# Altium schematic sheet POWR001_BCR_ LT3652.SchDoc: BLUEsat Peak Power Tracker
size A3; Author: William Du; Engineer: William Du; Organization: BLUEsat Project; Address1: Room 419; Address2: School of EE&T; Address3: UNSW, NSW 2052; Address4: Australia; DocumentNumber: POWR0001; SheetNumber: 1; SheetTotal: 1; PageSetup: Record=PageOptions?CenterHorizontal=True?CenterVertical=True?PrintScale=1.00?XCorrection=1.00?YCorrection=1.00?PrintKind=1?BorderSize=5000000?LeftOffset=0?BottomOffset=0?Orientation=2?PaperLength=1000?PaperWidth=1000?Scale=100?PaperSource=7?PrintQuality=-4?MediaType=1?DitherType=10?PaperKind=A4?PrintScaleMode=0; Description: Battery Charge Regulator; Version: 1.0
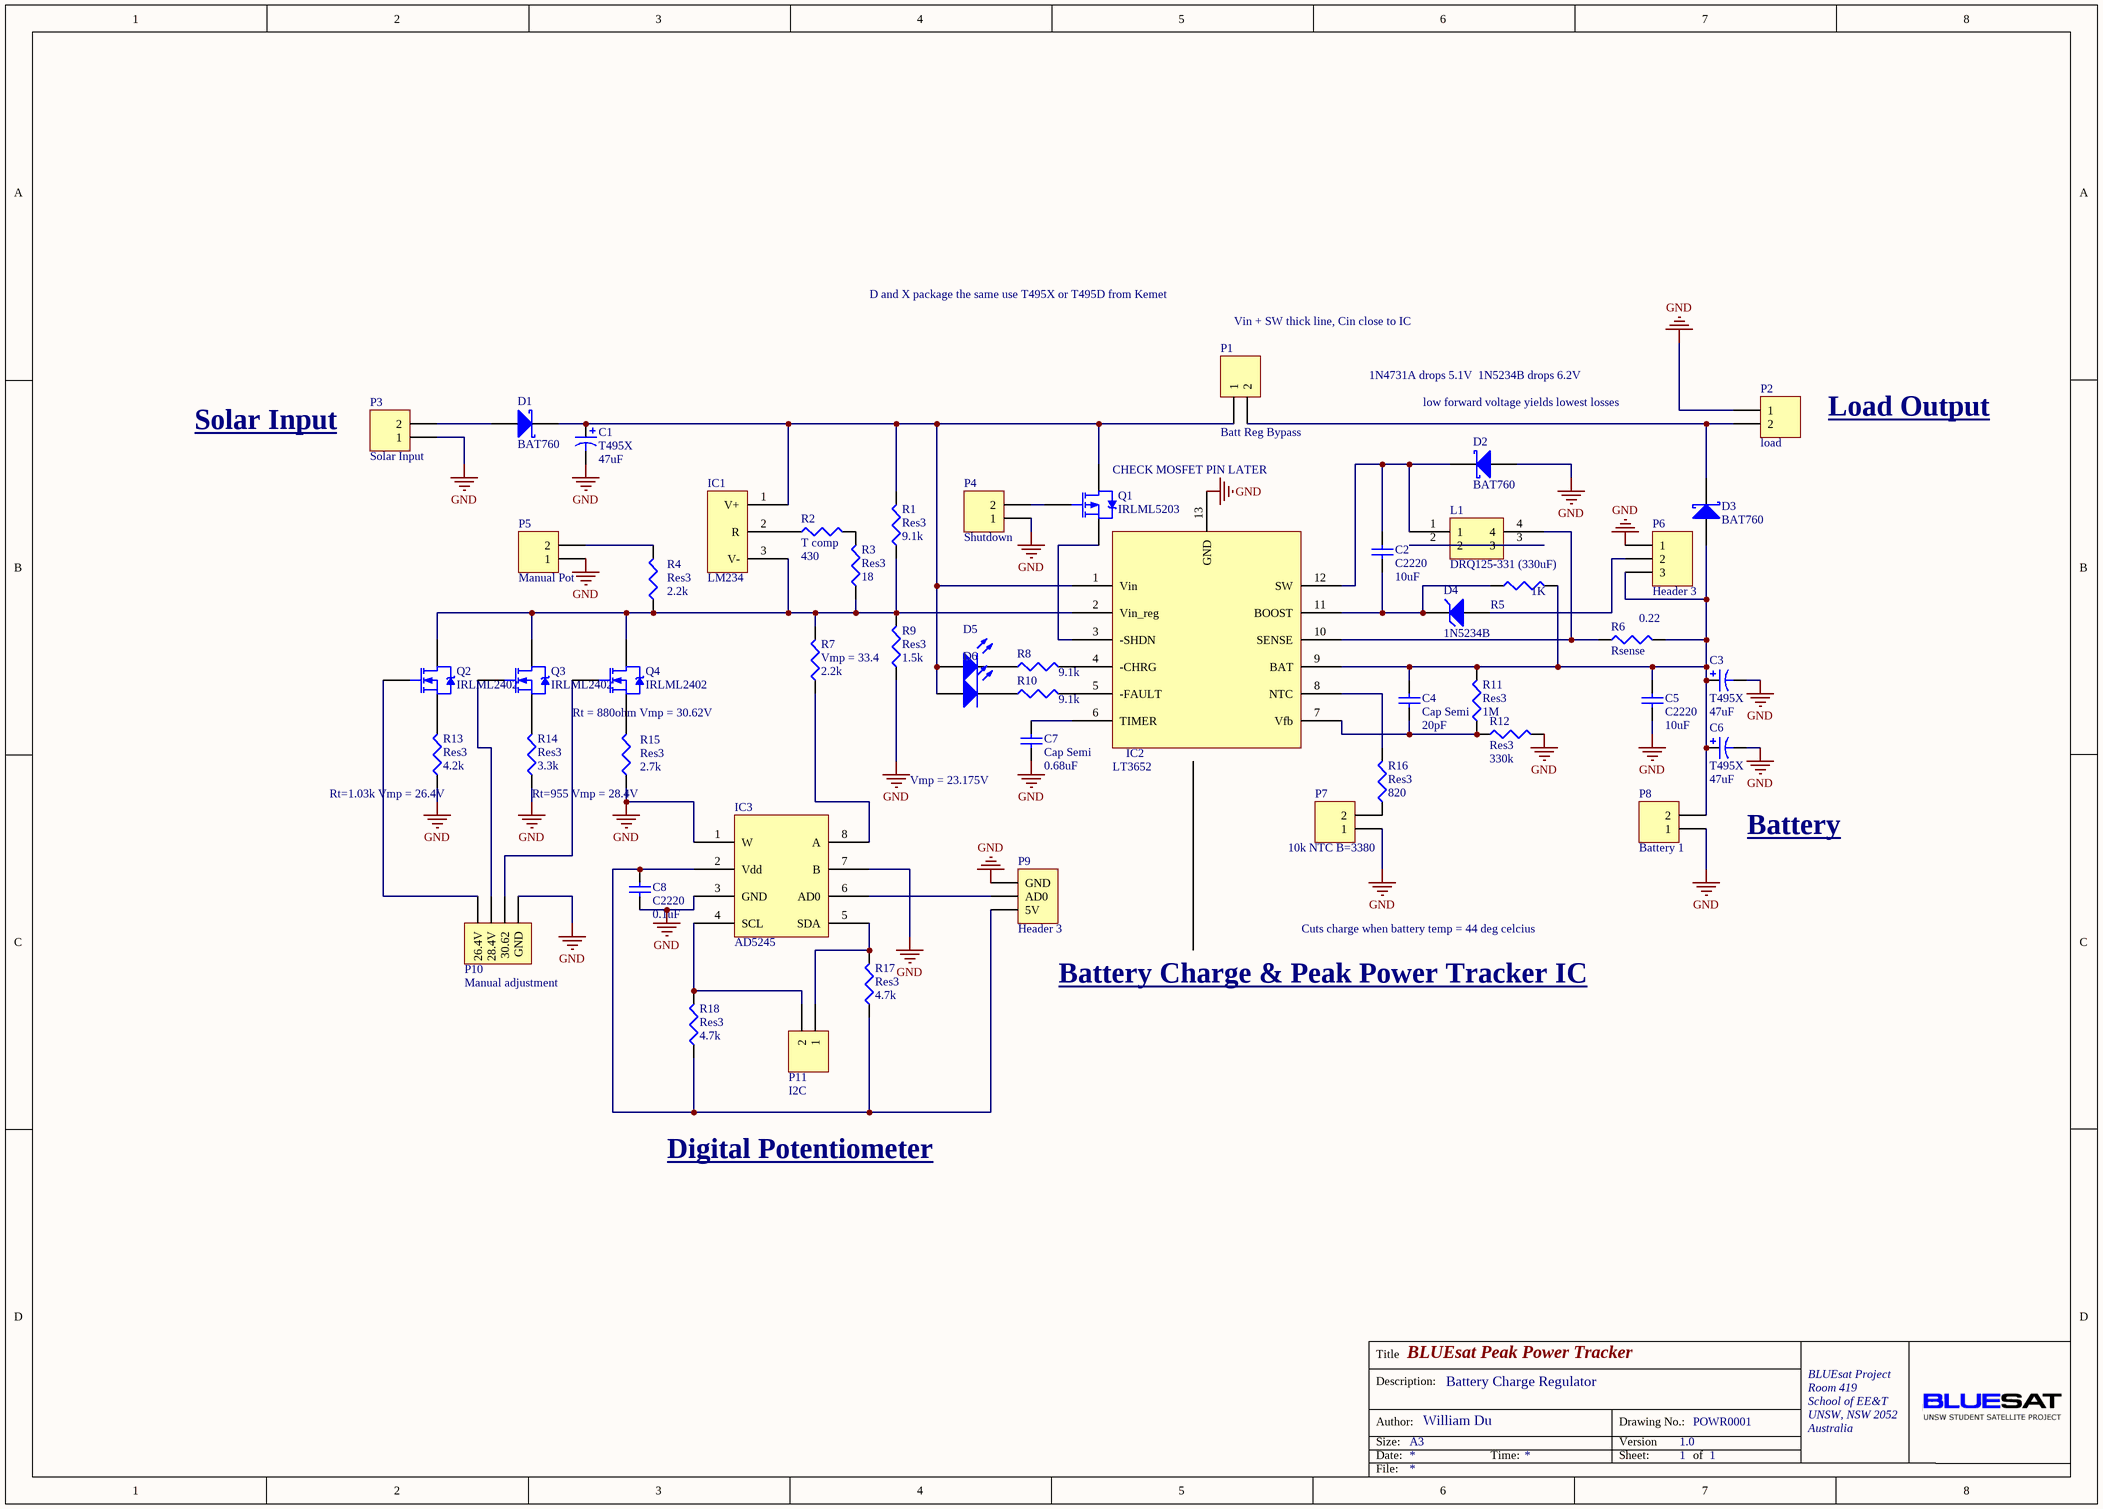
[diagram p0: POWR001_BCR_ LT3652.SchDoc]

## Parts
C1  T495X  value 47uF  [X]
C2  C2220  value 10uF  [2220]
C3  T495X  value 47uF  [X]
C4  Cap Semi  value 20pF  [CAPC3216L]
C5  C2220  value 10uF  [2220]
C6  T495X  value 47uF  [X]
C7  Cap Semi  value 0.68uF  [CAPC3216L]
C8  C2220  value 0.1uF  [2220]
D1  BAT760  [SOD323]
D2  BAT760  [SOD323]
D3  BAT760  [SOD323]
D4  1N5234B  [DO-35]
D5  (no value)  [DSO-C2/D5.6]
D6  (no value)  [DSO-C2/D5.6]
IC1  LM234  [HDR1X3]
IC2  LT3652  [MSOP12]
IC3  AD5245  [SOT23-8]
L1  DRQ125-331 (330uF)  [DRQ125]
P1  Batt Reg Bypass  [HDR1X2]
P2  load  [HDR1X2]
P3  Solar Input  [HDR1X2]
P4  Shutdown  [HDR1X2]
P5  Manual Pot  [HDR1X2]
P6  Header 3  [HDR1X3]
P7  10k NTC B=3380  [HDR1X2]
P8  Battery 1  [HDR1X2]
P9  Header 3  [HDR1X3]
P10  Manual adjustment  [HDR1X4]
P11  I2C  [HDR1X2]
Q1  IRLML5203  [SOT-23]
Q2  IRLML2402  [SOT-23]
Q3  IRLML2402  [SOT-23]
Q4  IRLML2402  [SOT-23]
R1  Res3  value 9.1k  [RESC1608L]
R2  T comp  value 430  [RESC1608L]
R3  Res3  value 18  [RESC1608L]
R4  Res3  value 2.2k  [RESC1608L]
R5  value 1K  [RESC1608L]
R6  Rsense  value 0.22  [RESC1608L]
R7  Vmp = 33.4  value 2.2k  [RESC1608L]
R8  value 9.1k  [RESC1608L]
R9  Res3  value 1.5k  [RESC1608L]
R10  value 9.1k  [RESC1608L]
R11  Res3  value 1M  [RESC2012M]
R12  Res3  value 330k  [RESC1608L]
R13  Res3  value 4.2k  [RESC1608L]
R14  Res3  value 3.3k  [RESC1608L]
R15  Res3  value 2.7k  [RESC1608L]
R16  Res3  value 820  [RESC1608L]
R17  Res3  value 4.7k  [RESC1608L]
R18  Res3  value 4.7k  [RESC1608L]

## Nets
GND: C1.2 C3.2 C5.1 C6.2 C7.1 C8.1 D2.1(A) IC2.13(GND) IC3.1(W) IC3.3(GND) IC3.7(B) P2.1 P3.1 P4.1 P5.1 P6.1 P7.1 P8.1 P9.1(GND) P10.1(GND) R9.1 R12.2 R13.1 R14.1 R15.1
NetC1_1: C1.1 D1.2(K) D5.1(A) D6.1(A) IC1.1(V+) IC2.1(Vin) P1.1 Q1.3(D) R1.2
NetC2_1: C2.1 D4.2(K) IC2.11(BOOST) R5.1
NetC2_2: C2.2 D2.2(K) IC2.12(SW) L1.1
NetC3_1: C3.1 C4.2 C5.2 C6.1 D3.1(A) IC2.9(BAT) P6.3 P8.2 R5.2 R6.2 R11.2
NetC4_1: C4.1 IC2.7(Vfb) R11.1 R12.1
NetC7_2: C7.2 IC2.6(TIMER)
NetC8_2: C8.2 IC3.2(Vdd) P9.3(5V) R17.1 R18.1
NetD1_1: D1.1(A) P3.2
NetD3_2: D3.2(K) P1.2 P2.2
NetD4_1: D4.1(A) P6.2
NetD5_2: D5.2(K) R8.1
NetD6_2: D6.2(K) R10.1
NetIC1_2: IC1.2(R) R2.1
NetIC1_3: IC1.3(V-) IC2.2(Vin_reg) Q2.3(D) Q3.3(D) Q4.3(D) R1.1 R3.1 R4.1 R7.2 R9.2
NetIC2_3: IC2.3(-SHDN) Q1.2(S)
NetIC2_4: IC2.4(-CHRG) R8.2
NetIC2_5: IC2.5(-FAULT) R10.2
NetIC2_8: IC2.8(NTC) R16.2
NetIC2_10: IC2.10(SENSE) L1.4 R6.1
NetIC3_4: IC3.4(SCL) P11.2 R18.2
NetIC3_5: IC3.5(SDA) P11.1 R17.2
NetIC3_6: IC3.6(AD0) P9.2(AD0)
NetIC3_8: IC3.8(A) R7.1
NetL1_2: L1.2 L1.3
NetP4_2: P4.2 Q1.1(G)
NetP5_2: P5.2 R4.2
NetP7_2: P7.2 R16.1
NetP10_2: P10.2(30.62) Q4.1(G)
NetP10_3: P10.3(28.4V) Q3.1(G)
NetP10_4: P10.4(26.4V) Q2.1(G)
NetQ2_2: Q2.2(S) R13.2
NetQ3_2: Q3.2(S) R14.2
NetQ4_2: Q4.2(S) R15.2
NetR2_2: R2.2 R3.2

## Notes on the sheet
- D and X package the same use T495X or T495D from Kemet
- Vin + SW thick line, Cin close to IC
- 1N4731A drops 5.1V  1N5234B drops 6.2V
- Solar Input
- low forward voltage yields lowest losses
- Load Output
- (near Q1) CHECK MOSFET PIN LATER
- Rt = 880ohm Vmp = 30.62V
- (near C7) Vmp = 23.175V
- (near R13) Rt=1.03k Vmp = 26.4V
- Rt=955 Vmp = 28.4V
- Battery
- Battery Charge & Peak Power Tracker IC
- Cuts charge when battery temp = 44 deg celcius
- Digital Potentiometer
- Title
- Description:
- Size:
- Author:
- Date:
- A3
- Time:
- Version
- Sheet:
- Drawing No.:
- of
- File:

## Library data of the parts
C1 C3 C6 = T495X: Solid Tantalum Chip Capacitor, Standard T495 Series - Low ESR, Surge Robust; PCB_Layout: Round Glue Pad at 2.9 ?.1mm in diameter at KEMET's option; Published: 17-Jul-2002; LatestRevisionDate: 19-Mar-2004; LatestRevisionNote: Silkscreen dimensions re-sized.; DatasheetDocument: Mar-2001; PackageDocument: Mar-2001; PackageReference: X; Publisher: Altium Limited; Code_JEITA: 7343-43; ComponentLink1Description: Manufacturer Link; ComponentLink1URL: http://www.kemet.com/; ComponentLink2Description: Datasheet; ComponentLink2URL: http://www.kemet.com/kemet/web/homepage/kechome.nsf/vapubfilesname/F3102TA.pdf/$file/F3102TA.pdf
C2 C5 C8 = C2220: Ceramic Chip Capacitor - Standard; Published: 17-Jul-2002; LatestRevisionDate: 19-Mar-2004; LatestRevisionNote: Silkscreen size reduced.; DatasheetDocument: Mar-2001; PackageDocument: Mar-2001; PackageReference: 2220; Publisher: Altium Limited; Code_JEITA: 2220; ComponentLink1Description: Manufacturer Link; ComponentLink1URL: http://www.kemet.com/; ComponentLink2Description: Datasheet; ComponentLink2URL: http://www.kemet.com/kemet/web/homepage/kechome.nsf/vapubfilesname/F3102TA.pdf/$file/F3102TA.pdf
C4 C7 = Cap Semi: Capacitor (Semiconductor SIM Model); Published: 8-Jun-2000; LatestRevisionDate: 29-May-2009; LatestRevisionNote: IPC-7351 Footprint Added.; PackageReference: C1206; Publisher: Altium Limited; PackageDescription: Chip Capacitor
D1-D3 = D Schottky: Schottky Diode; Published: 8-Jun-2000; LatestRevisionDate: 17-Jul-2002; LatestRevisionNote: Re-released for DXP Platform.; PackageReference: SMB; Publisher: Altium Limited; Code_JEDEC: DO-214-AA
D4 = 1N5234B: Half Watt Zener; Published: 8-Jun-2000; LatestRevisionDate: 17-Jul-2002; LatestRevisionNote: Re-released for DXP Platform.; DatasheetDocument: 1997; PackageReference: DO-35; Publisher: Altium Limited; Code_JEDEC: DO-204-AH; ComponentLink1Description: Manufacturer Link; ComponentLink1URL: http://www.fairchildsemi.com/; ComponentLink2Description: Datasheet; ComponentLink2URL: http://www.fairchildsemi.com/ds/1N%2F1N5226B.pdf
D5 D6 = LED3: Typical BLUE SiC LED; Published: 8-Jun-2000; LatestRevisionDate: 17-Dec-2003; LatestRevisionNote: PCB Footprint replaced.; DatasheetVersion: 16-Apr-2002; PackageVersion: 16-Apr-2002; PackageReference: 3.5X2.8X1.9; Publisher: Altium Limited
L1 = DRQ125-331
P1-P5 P7 P8 P11 = Header 2: Header, 2-Pin; LatestRevisionDate: 17-Jul-2002; LatestRevisionNote: Re-released for DXP Platform.; Publisher: Altium Limited
P6 P9 = Header 3: Header, 3-Pin; LatestRevisionDate: 17-Jul-2002; LatestRevisionNote: Re-released for DXP Platform.; Publisher: Altium Limited
P10 = Header 4: Header, 4-Pin; LatestRevisionDate: 17-Jul-2002; LatestRevisionNote: Re-released for DXP Platform.; Publisher: Altium Limited
Q1 = IRLML5103: HEXFET Power MOSFET 9103511; Published: 8-Jun-2000; LatestRevisionDate: 17-Jul-2002; LatestRevisionNote: Re-released for DXP Platform.; DatasheetVersion: Aug-1997; PackageReference: SOT-23; Publisher: Altium Limited; PackageDescription: SOT-23; 3 Leads; Body 3.1 x 2.5 mm, inc. leads (LxW max); ComponentLink1Description: Manufacturer Link; ComponentLink1URL: http://www.irf.com/; ComponentLink2Description: Datasheet; ComponentLink2URL: http://www.irf.com/product-info/datasheets/data/irlml5103.pdf
Q2-Q4 = IRLML2402: HEXFET Power MOSFET; Published: 8-Jun-2000; LatestRevisionDate: 17-Jul-2002; LatestRevisionNote: Re-released for DXP Platform.; DatasheetVersion: Aug-1997; PackageReference: SOT-23; Publisher: Altium Limited; PackageDescription: SOT-23; 3 Leads; Body 3.1 x 2.5 mm, inc. leads (LxW max); ComponentLink1Description: Manufacturer Link; ComponentLink1URL: http://www.irf.com/; ComponentLink2Description: Datasheet; ComponentLink2URL: http://www.irf.com/product-info/datasheets/data/irlml2402.pdf
R1-R18 = Res3: Resistor; Published: 8-Jun-2000; LatestRevisionDate: 29-May-2009; LatestRevisionNote: IPC-7351 Footprint Added.; PackageReference: J1-0603; Publisher: Altium Limited; PackageDescription: Chip Resistor